# Altium project 105358-3BA001-01_EFM1.PrjPCB
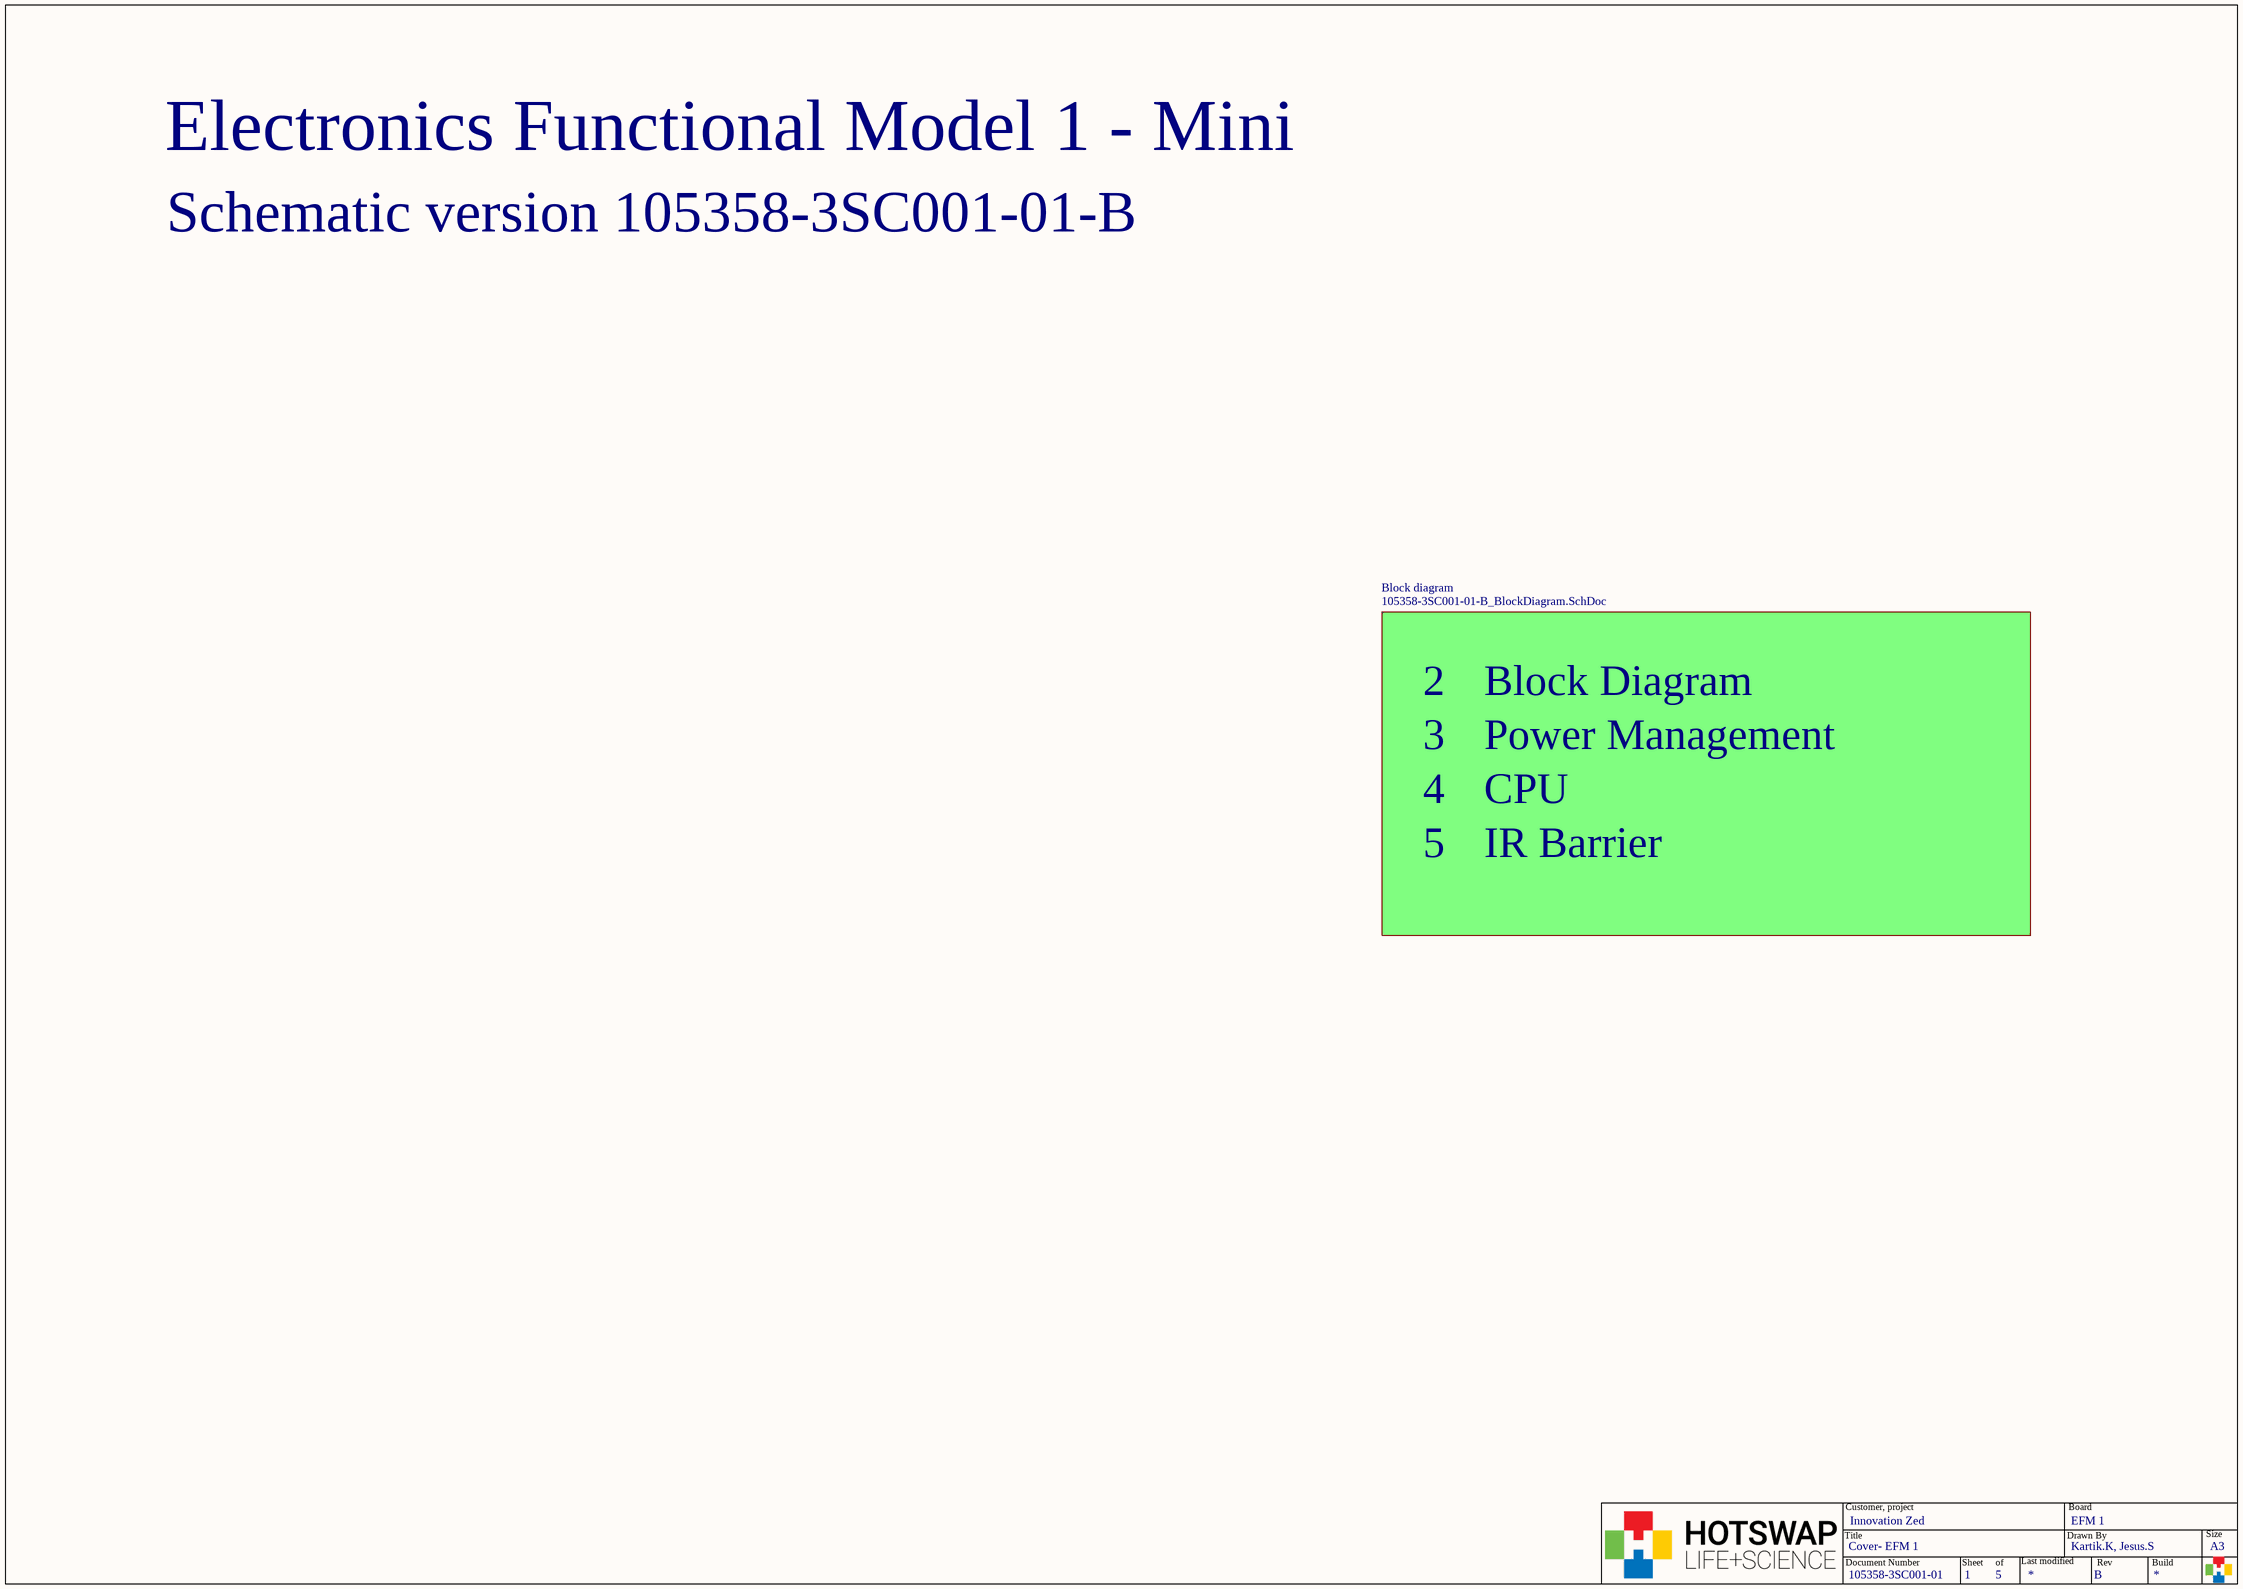
[diagram p0: 105358-3SC001-01-B_Cover.SchDoc]
PrjVersionControl_RevNumber: ' A '; Project_Board: EFM 1; Project_Customer: Innovation Zed; Project_Document_Number: 105358-3BA001-01-B; Project_Drawn_By: Kartik.K, Jesus.S; Project_Revision: B; Project_Total_Sheets: X
5 sheets, 89 parts. Net scope: flat (ports and power ports of the same name join across sheets).
Board file: 105358-3LA001-01_EFM1.PcbDoc
Sheets:
  105358-3SC001-01-B_Cover.SchDoc
    Block diagram = 105358-3SC001-01-B_BlockDiagram.SchDoc
      Power Management = 105358-3SC001-01-B_PWR_MGMT.SchDoc
      CPU Board = 105358-3SC001-01-B_CPU_BRD.SchDoc
      IO Board = 105358-3SC001-01-B_IO_BRD.SchDoc

## Sheet 105358-3SC001-01-B_Cover.SchDoc: Cover- EFM 1
size 420 x 297 mm; DrawnBy: JeSa, KaKa; Organization: Hotswap Norden AB; Address1: Knarrarnäsgatan 7; Address2: SE-164 40 Kista; Address3: Sweden; DocumentNumber: 105358-3SC001-01; SheetNumber: 1; SheetTotal: 5; PageSetup: Record=PageOptions|CenterHorizontal=True|CenterVertical=True|PrintScale=0.98|XCorrection=1.00|YCorrection=1.00|PrintKind=0|BorderSize=5000000|LeftOffset=0|BottomOffset=0|Orientation=2|PaperLength=1000|PaperWidth=1000|Scale=100|PaperSource=7|PrintQuality=-3|MediaType=1|DitherType=10|PrintScaleMode=1|PaperKind=A3|PaperIndex=8

### Sub-sheets
Block diagram = 105358-3SC001-01-B_BlockDiagram.SchDoc: no entries

### Notes on the sheet
- Electronics Functional Model 1 - Mini
- Schematic version 105358-3SC001-01-B
- 2
- Block Diagram
- 3
- Power Management
- 4
- 5
- IR Barrier
- CPU
- Title
- Customer, project
- Drawn By
- Board
- Size
- Document Number
- Sheet
- of
- Last modified
- Rev
- Build
- A3

## Sheet 105358-3SC001-01-B_BlockDiagram.SchDoc: Block Diagram
size 420 x 297 mm; DrawnBy: JeSa , KaKa; Organization: Hotswap Norden AB; Address1: Knarrarnäsgatan 7; Address2: SE-164 40 Kista; Address3: Sweden; DocumentNumber: 105358-3SC001-01; SheetNumber: 2; SheetTotal: 5; PageSetup: Record=PageOptions|CenterHorizontal=True|CenterVertical=True|PrintScale=0.96|XCorrection=1.00|YCorrection=1.00|PrintKind=0|BorderSize=5000000|LeftOffset=0|BottomOffset=0|Orientation=2|PaperLength=1000|PaperWidth=1000|Scale=100|PaperSource=7|PrintQuality=-4|MediaType=1|DitherType=10|PaperKind=A3|PrintScaleMode=1
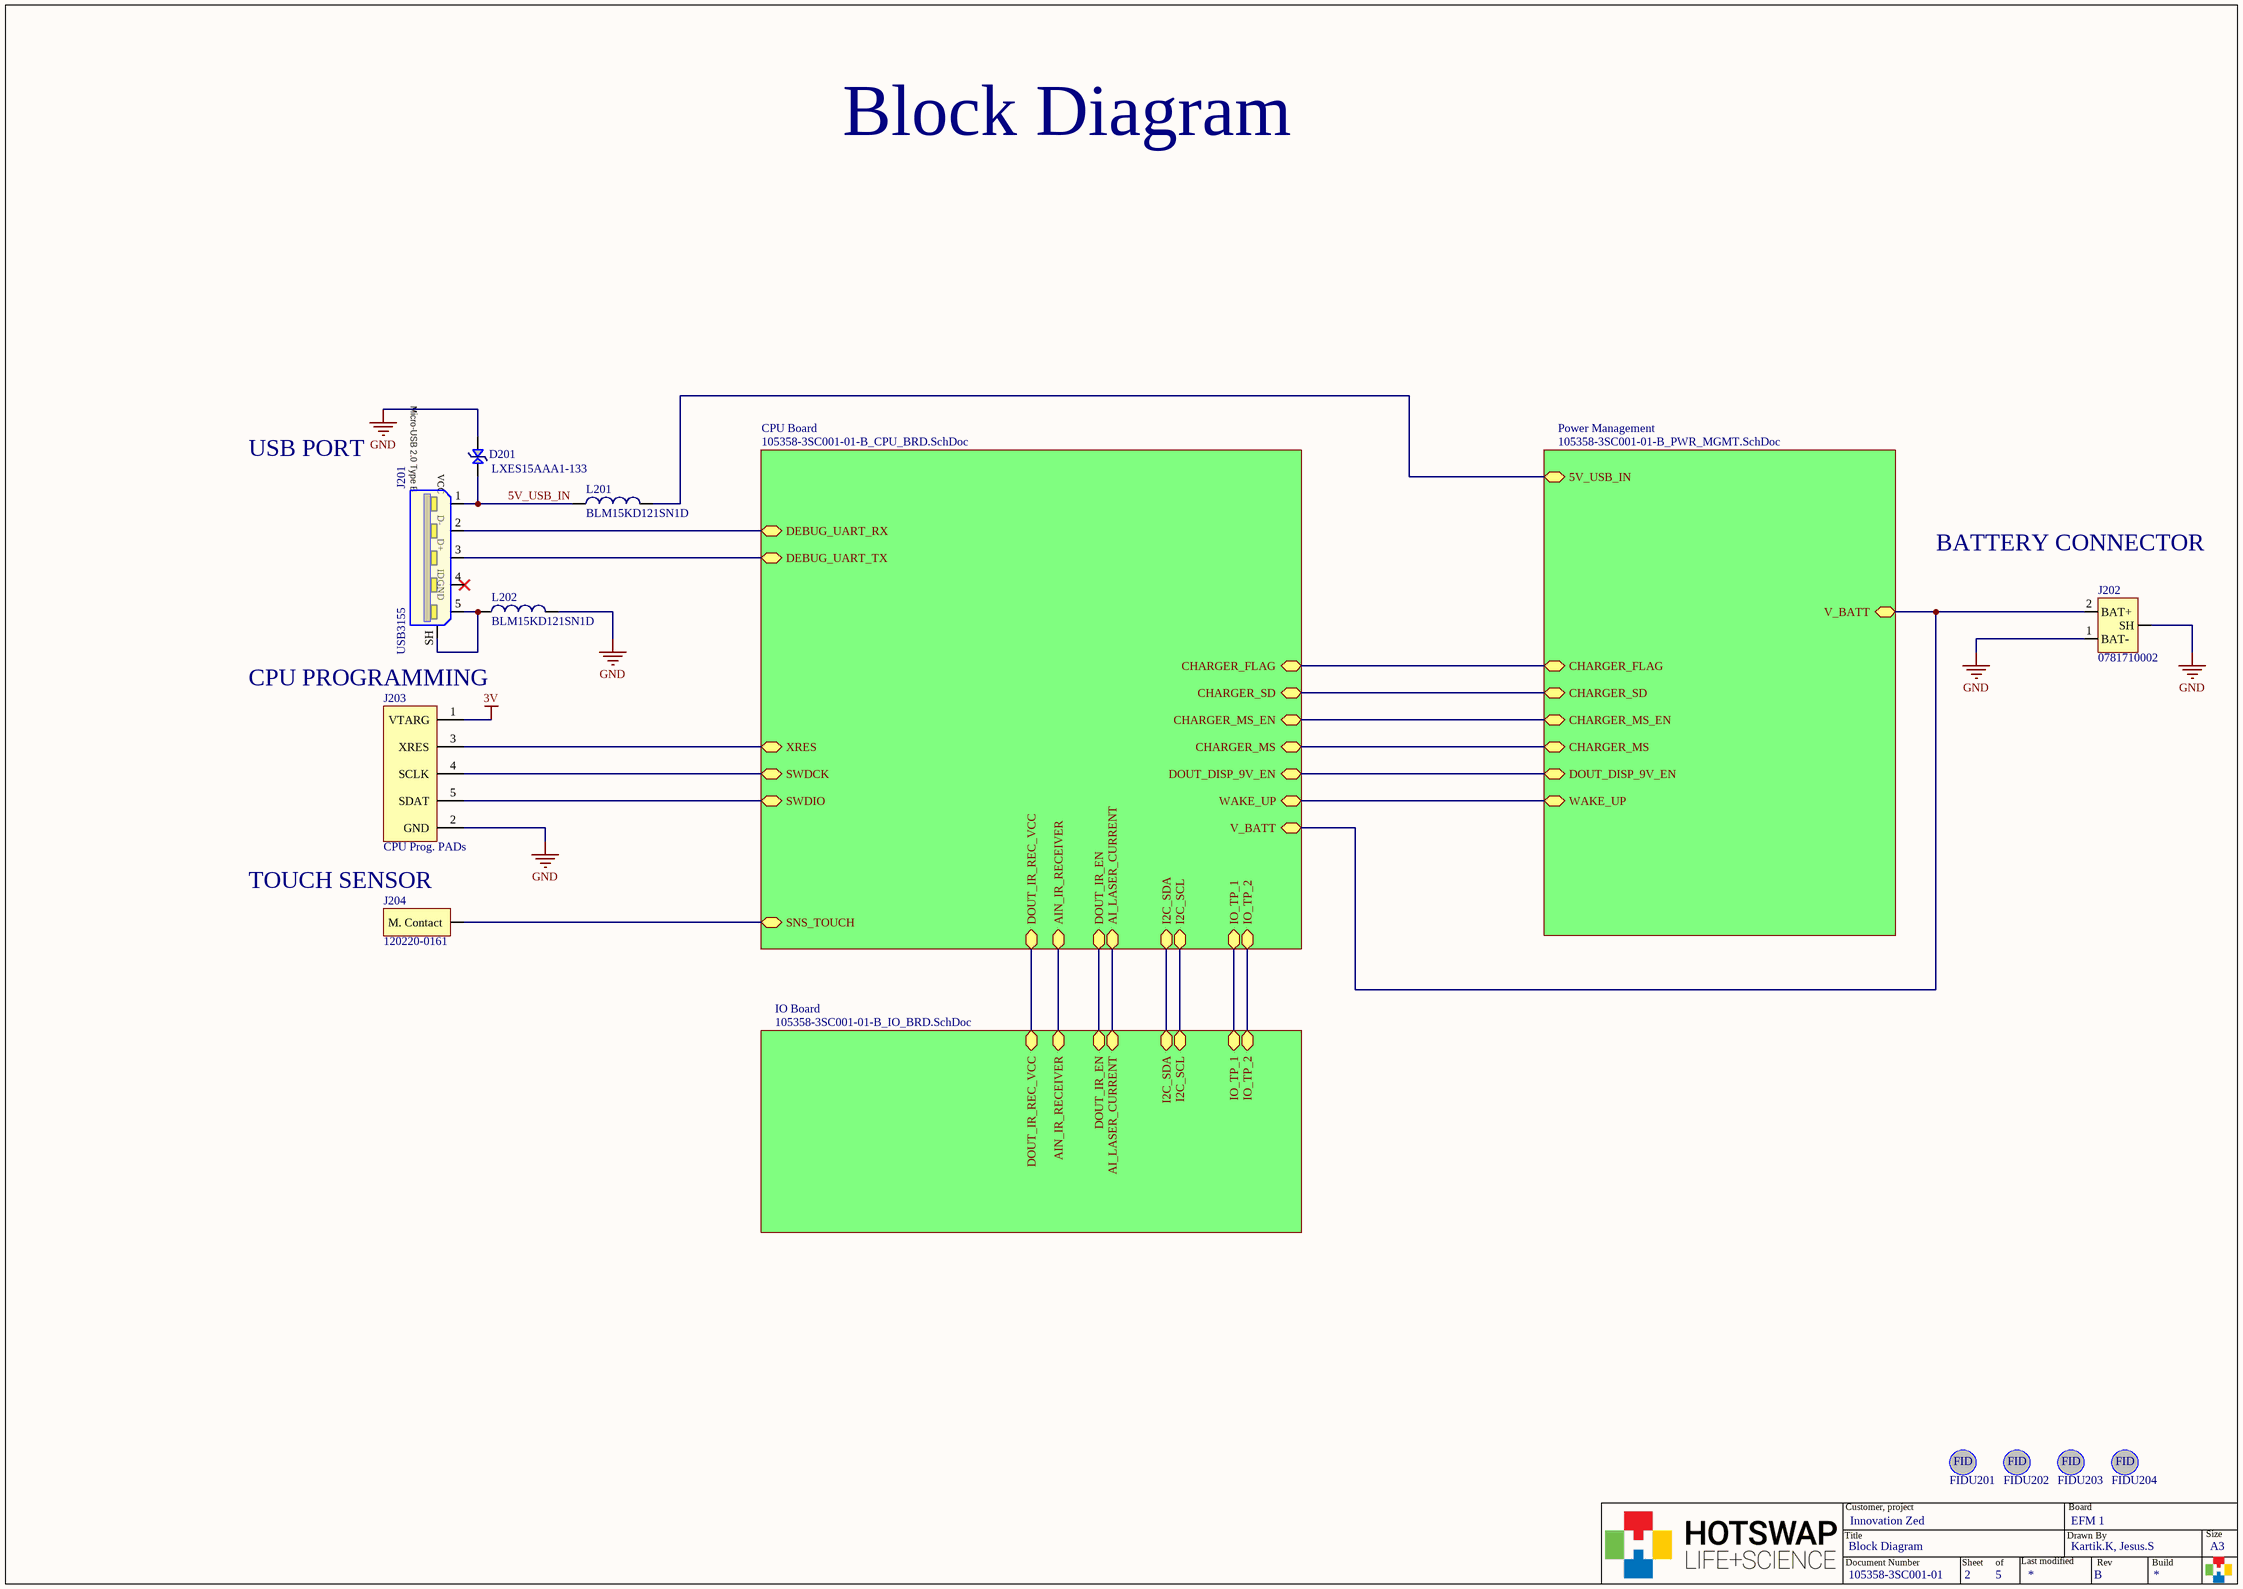
[diagram p1: 105358-3SC001-01-B_BlockDiagram.SchDoc]

### Parts
D201  LXES15AAA1-133  [0402C-GENERIC]
FIDU201  FIDU-miniROUND  [FIDU-MINI-ROUND]  (value not drawn)  (no BOM)
FIDU202  FIDU-miniROUND  [FIDU-MINI-ROUND]  (value not drawn)  (no BOM)
FIDU203  FIDU-miniROUND  [FIDU-MINI-ROUND]  (value not drawn)  (no BOM)
FIDU204  FIDU-miniROUND  [FIDU-MINI-ROUND]  (value not drawn)  (no BOM)
J201  USB3155  [USB3155]
J202  0781710002  [PAD 0781710002]
J203  CPU Prog. PADs  [PAD PROGRAMMING]  (no BOM)
J204  120220-0161  [PAD 1.0x3.76mm]
L201  BLM15KD121SN1D  [0402L_High Speed]
L202  BLM15KD121SN1D  [0402L_High Speed]

### Sub-sheets
CPU Board = 105358-3SC001-01-B_CPU_BRD.SchDoc: DEBUG_UART_TX, CHARGER_FLAG, DEBUG_UART_RX, CHARGER_MS, CHARGER_SD, CHARGER_MS_EN, WAKE_UP, DOUT_DISP_9V_EN, XRES, SWDCK, SWDIO, AIN_IR_RECEIVER, I2C_SDA, I2C_SCL, IO_TP_1, IO_TP_2, SNS_TOUCH, AI_LASER_CURRENT, DOUT_IR_REC_VCC, DOUT_IR_EN, V_BATT
IO Board = 105358-3SC001-01-B_IO_BRD.SchDoc: AIN_IR_RECEIVER, I2C_SDA, I2C_SCL, IO_TP_1, IO_TP_2, AI_LASER_CURRENT, DOUT_IR_REC_VCC, DOUT_IR_EN
Power Management = 105358-3SC001-01-B_PWR_MGMT.SchDoc: CHARGER_FLAG, CHARGER_MS_EN, CHARGER_SD, CHARGER_MS, WAKE_UP, DOUT_DISP_9V_EN, 5V_USB_IN, V_BATT

### Nets
3V: J203.1(VTARG)
GND: D201.1 J202.1(BAT-) J202.3(SH) J203.2(GND) L202.2
5V_USB_IN: D201.2 J201.1(VCC) L201.1  [project net 5V_USB_IN_2]
NetJ201_2: J201.2(D-) ; sheet CPU Board/DEBUG_UART_RX
NetJ201_3: J201.3(D+) ; sheet CPU Board/DEBUG_UART_TX
NetJ201_5: J201.5(GND) J201.SH(Shell) L202.1
NetJ202_2: J202.2(BAT+) ; sheet Power Management/V_BATT, sheet CPU Board/V_BATT
NetJ203_3: J203.3(XRES) ; sheet CPU Board/XRES
NetJ203_4: J203.4(SCLK) ; sheet CPU Board/SWDCK
NetJ203_5: J203.5(SDAT) ; sheet CPU Board/SWDIO
NetJ204_1: J204.1(M._Contact) ; sheet CPU Board/SNS_TOUCH
NetL201_2: L201.2 ; sheet Power Management/5V_USB_IN
(unnamed): sheet Power Management/CHARGER_FLAG, sheet CPU Board/CHARGER_FLAG
(unnamed): sheet Power Management/CHARGER_MS_EN, sheet CPU Board/CHARGER_MS_EN
(unnamed): sheet Power Management/CHARGER_SD, sheet CPU Board/CHARGER_SD
(unnamed): sheet Power Management/CHARGER_MS, sheet CPU Board/CHARGER_MS
(unnamed): sheet Power Management/WAKE_UP, sheet CPU Board/WAKE_UP
(unnamed): sheet Power Management/DOUT_DISP_9V_EN, sheet CPU Board/DOUT_DISP_9V_EN
(unnamed): sheet CPU Board/AIN_IR_RECEIVER, sheet IO Board/AIN_IR_RECEIVER
(unnamed): sheet CPU Board/I2C_SDA, sheet IO Board/I2C_SDA
(unnamed): sheet CPU Board/I2C_SCL, sheet IO Board/I2C_SCL
(unnamed): sheet CPU Board/IO_TP_1, sheet IO Board/IO_TP_1
(unnamed): sheet CPU Board/IO_TP_2, sheet IO Board/IO_TP_2
(unnamed): sheet CPU Board/AI_LASER_CURRENT, sheet IO Board/AI_LASER_CURRENT
(unnamed): sheet CPU Board/DOUT_IR_REC_VCC, sheet IO Board/DOUT_IR_REC_VCC
(unnamed): sheet CPU Board/DOUT_IR_EN, sheet IO Board/DOUT_IR_EN

Not connected (* = marked no-connect by the designer): J201 4(ID)*

### Notes on the sheet
- Block Diagram
- USB PORT
- BATTERY CONNECTOR
- CPU PROGRAMMING
- TOUCH SENSOR
- Title
- Customer, project
- Drawn By
- Board
- Size
- Document Number
- Sheet
- of
- Last modified
- Rev
- Build
- A3
- (in symbol FIDU-miniROUND) FID
- (in symbol USB3155) Micro-USB 2.0 Type B

### Library data of the parts
D201 = TVS DIODE 15VWM 0402: Manufacturer: Murata Electronics North America; Type: Zener; Capacitance @ Frequency: 0.05pF @ 1MHz; Voltage - Reverse Standoff (Typ): 15V; Manufacturer Part Number: LXES15AAA1-133; Digi-Key Part Number: 490-13209-1-ND; PackageReference: 0402
J201 = USB3155: CONN RCPT USB-mini B 2.0 5POS SLD; Manufacturer: GCT (GLOBAL CONNECTOR TECHNOLOGY); Manufacturer Part Number: USB3155-30-A; Connector Type: USB - micro B; ComponentLink1Description: Datasheet; ComponentLink1URL: https://gct.co/files/drawings/usb3155.pdf; Digi-Key Part Number: 2537026-Farnell; ClassName: 3D_EXPORT; ComponentLink2Description: Product Specification; ComponentLink2URL: https://gct.co/files/specs/usb3155-spec.pdf
J202 = CONNECTOR 1.20MM WTB HEADER VERT 2POS: 1.20MM WTB HEADER VERT 2POS; Manufacturer: Molex, LLC; ComponentLink1URL: http://www.molex.com/pdm_docs/sd/781710002_sd.pdf; ComponentLink1Description: Datasheet; Manufacturer Part Number: 0781710002; Mounting Type: Surface Mount; Digi-Key Part Number: WM4459CT-ND; ClassName: 3D_EXPORT
J203 = PROGRAMMING PADS: CPU Programming PADs; ClassName: TP
J204 = UNIVERSAL_CONTACT_2.5MM SMD: UNIVERSAL CONTACT 2.5MM SMD; Manufacturer: ITT Cannon, LLC; ComponentLink1URL: https://media.digikey.com/pdf/Data%20Sheets/ITT%20PDFs/Universal_Contact%202.5mm.pdf; ComponentLink1Description: Datasheet; Manufacturer Part Number: 120220-0161; Mounting Type: Surface Mount; Digi-Key Part Number: 1003-1009-1-ND; ClassName: 3D_EXPORT
L201 L202 = 0402L_FERRITE BEAD: FERRITE BEAD 120 OHM 0402 1LN; Manufacturer: Murata Electronics North America; Number of Lines: 1; Current Rating (Max): 1.5A; Impedance @ Frequency: 120 Ohm @ 100MHz; DC Resistance (DCR) (Max): 70 mOhm; Filter Type: Signal Line; Digi-Key Part Number: 490-15015-1-ND; Manufacturer Part Number: BLM15KD121SN1D; ComponentLink1Description: Datasheet; ComponentLink1URL: http://www.murata.com/en-us/products/productdata/8796740059166/ENFA0018.pdf; PackageReference: 0402 (1005 Metric)
FIDU201-FIDU204 = FIDU-miniROUND: ClassName: FIDU

## Sheet 105358-3SC001-01-B_PWR_MGMT.SchDoc: Power Management
size 420 x 297 mm; DrawnBy: JeSa, KaKa; Organization: Hotswap Norden AB; Address1: Knarrarnäsgatan 7; Address2: SE-164 40 Kista; Address3: Sweden; DocumentNumber: 105358-3SC001-01; SheetNumber: 3; SheetTotal: 5; PageSetup: Record=PageOptions|CenterHorizontal=True|CenterVertical=True|PrintScale=0.96|XCorrection=1.00|YCorrection=1.00|PrintKind=0|BorderSize=5000000|LeftOffset=0|BottomOffset=0|Orientation=2|PaperLength=1000|PaperWidth=1000|Scale=100|PaperSource=7|PrintQuality=-4|MediaType=1|DitherType=10|PaperKind=A3|PrintScaleMode=1
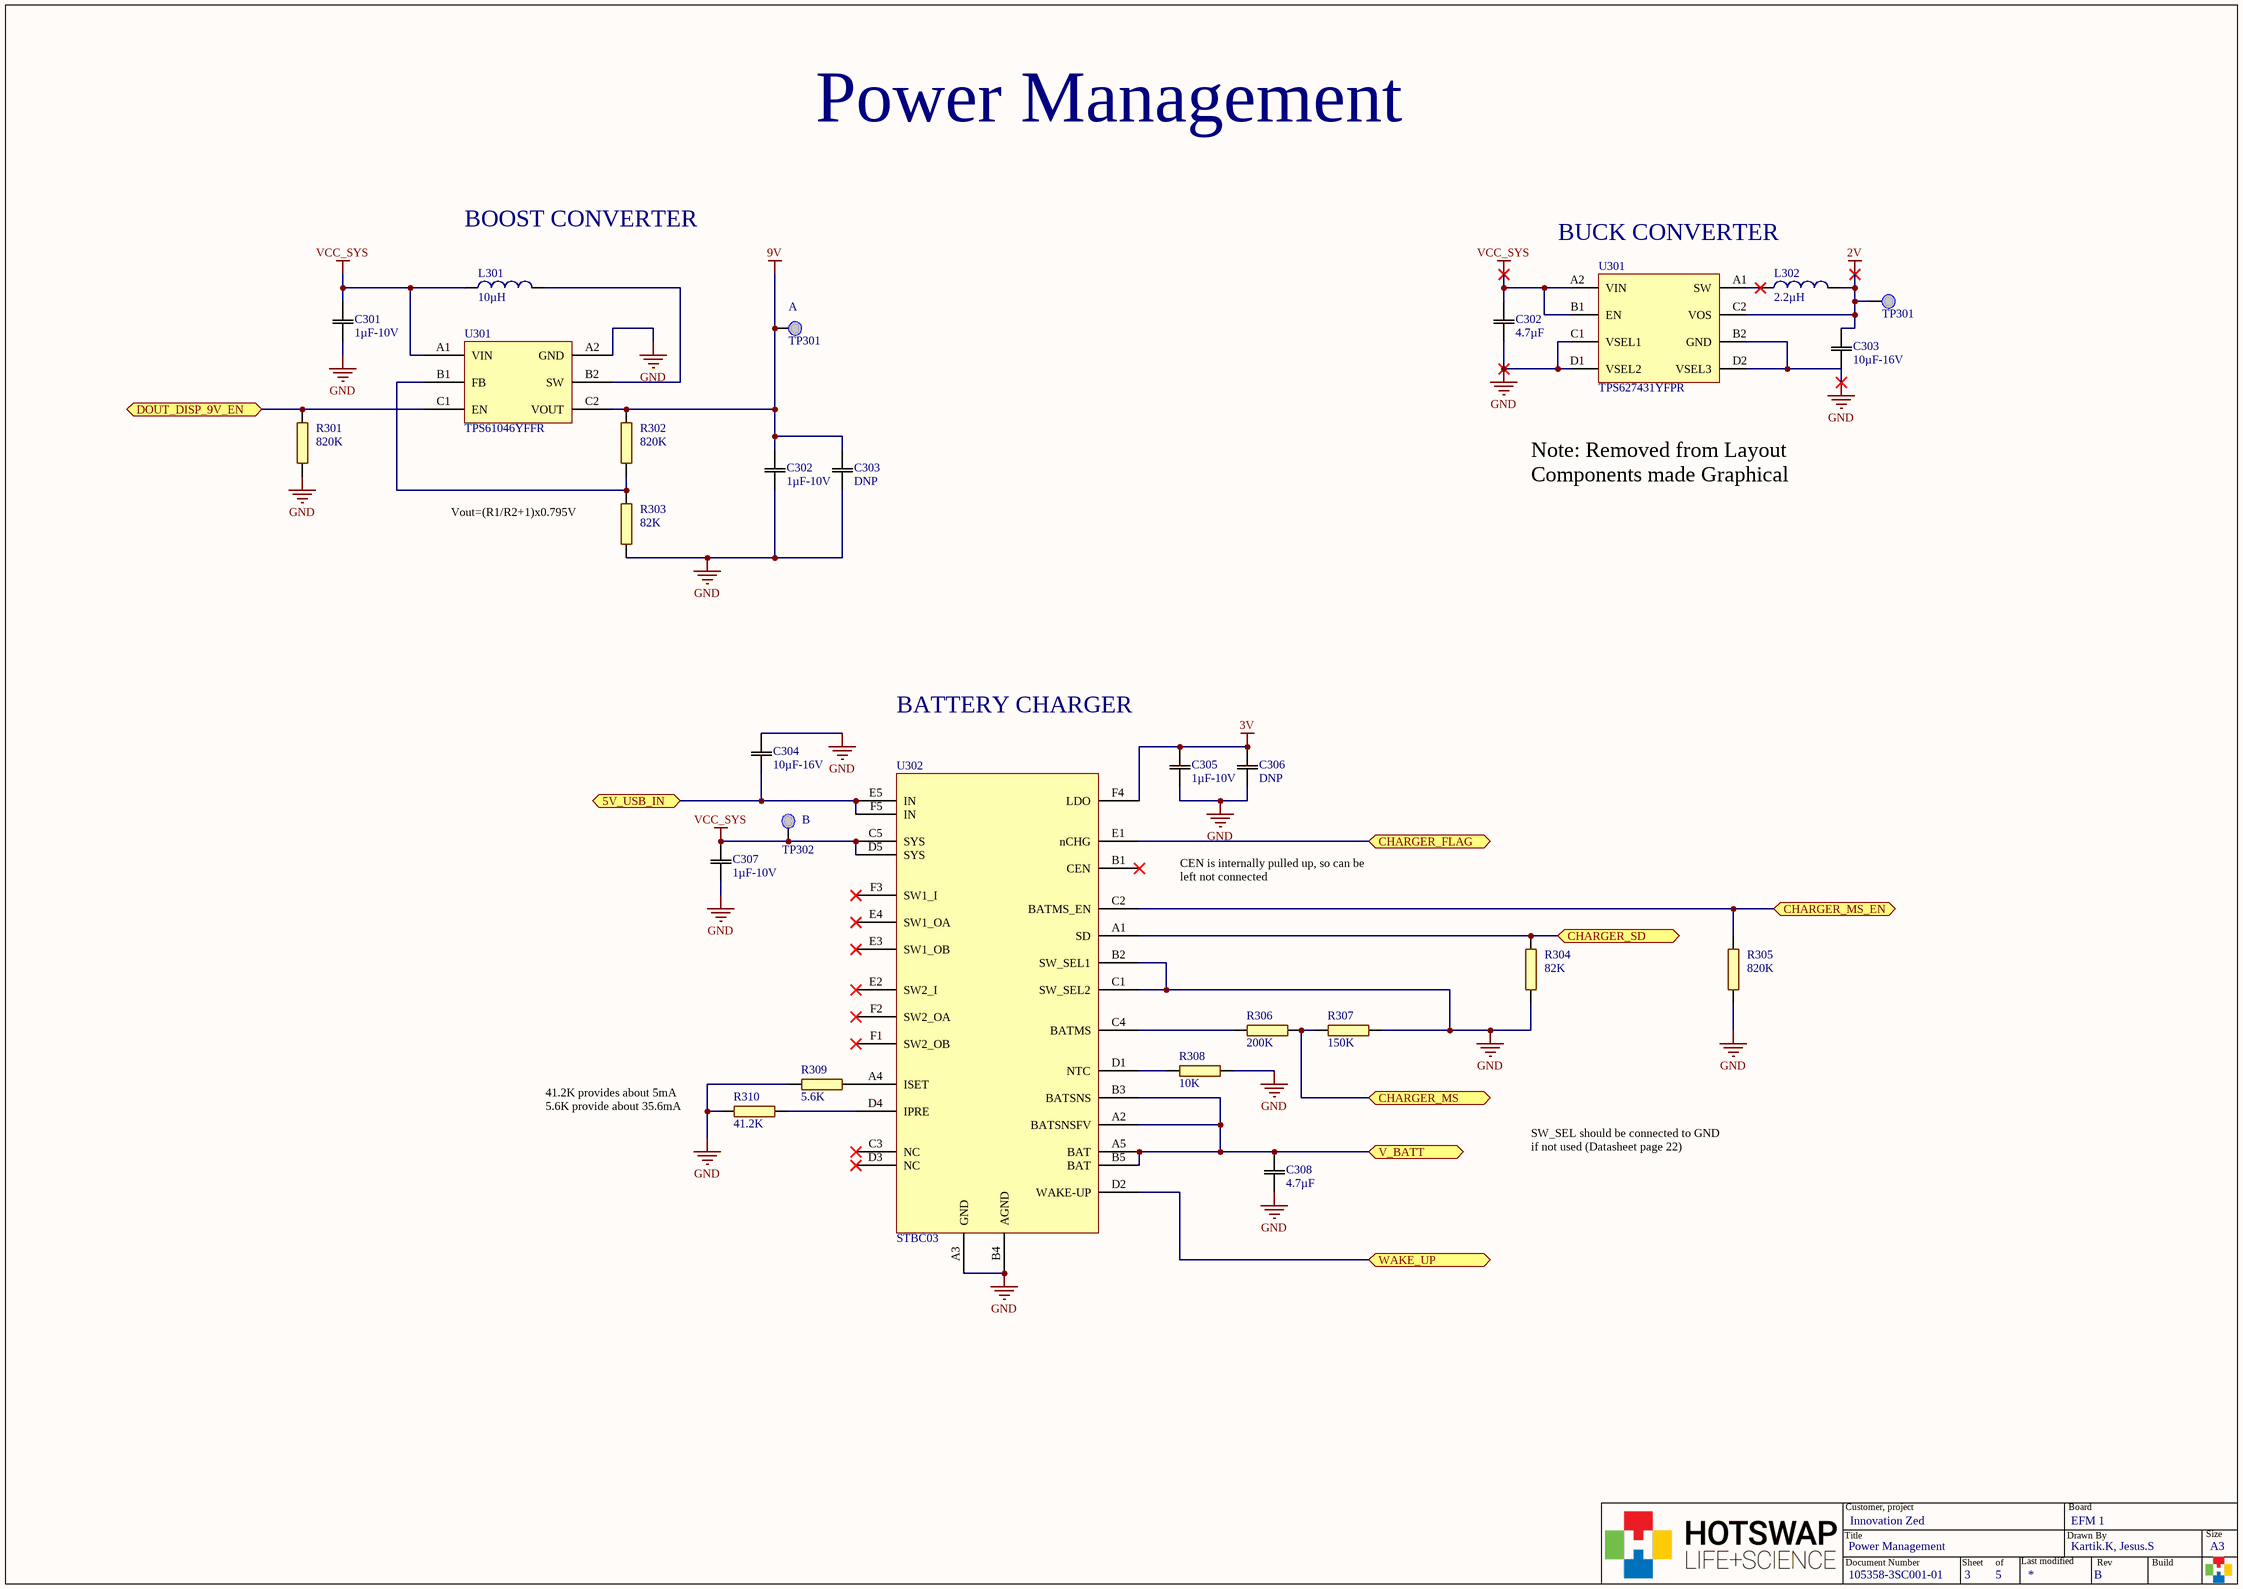
[diagram p2: 105358-3SC001-01-B_PWR_MGMT.SchDoc]

### Parts
(Parts that share a designator on the sheet are numbered #1, #2 ... from top to bottom, then left to right.)
C301  1µF-10V  [0402C_HIGH_DENSITY]
C302#1  4.7µF  [0402C_HIGH_DENSITY]  (graphical)
C302#2  1µF-10V  [0402C_HIGH_DENSITY]
C303#1  10µF-16V  [0603C_HIGH_DENSITY]  (graphical)
C303#2  DNP  [0402C-GENERIC]
C304  10µF-16V  [0603C_HIGH_DENSITY]
C305  1µF-10V  [0402C_HIGH_DENSITY]
C306  DNP  [0603C-GENERIC]
C307  1µF-10V  [0402C_HIGH_DENSITY]
C308  4.7µF  [0402C_HIGH_DENSITY]
L301  10µH  [0805L_HIGH_DENSITY]
L302  2.2µH  [0805L_HIGH_DENSITY]  (graphical)
R301  820K  [0402R-GENERIC]
R302  820K  [0402R-GENERIC]
R303  82K  [0402R-GENERIC]
R304  82K  [0402R-GENERIC]
R305  820K  [0402R-GENERIC]
R306  200K  [0402R-GENERIC]
R307  150K  [0402R-GENERIC]
R308  10K  [0402R-GENERIC]
R309  5.6K  [0402R-GENERIC]
R310  41.2K  [0402R-GENERIC]
TP301#1  TEST POINT  [PAD TEST POINT]  (value not drawn)  (graphical)
TP301#2  TEST POINT  [PAD TEST POINT]  (value not drawn)  (no BOM)
TP302  TEST POINT  [PAD TEST POINT]  (value not drawn)  (no BOM)
U301#1  TPS627431YFPR  [TPS627431YFPR]  (graphical)
U301#2  TPS61046YFFR  [TPS61046YFFR]
U302  STBC03  [STBC03]

### Ports
5V_USB_IN, CHARGER_FLAG, CHARGER_MS, CHARGER_MS_EN, CHARGER_SD, DOUT_DISP_9V_EN, V_BATT, WAKE_UP

### Nets
2V: C303#1.2 L302.2 TP301#1.1(Test_Point) U301#1.C2(VOS)
3V: C305.2 C306.2 U302.F4(LDO)
9V: C302#2.2 C303#2.2 R302.1 TP301#2.1(Test_Point) U301#2.C2(VOUT)
GND: C301.1 C302#1.1 C302#2.1 C303#1.1 C303#2.1 C304.2 C305.1 C306.1 C307.1 C308.1 R301.2 R303.2 R304.2 R305.2 R307.2 R308.2 R309.1 R310.1 U301#1.B2(GND) U301#1.C1(VSEL1) U301#1.D1(VSEL2) U301#1.D2(VSEL3) U301#2.A2(GND) U302.A3(GND) U302.B2(SW_SEL1) U302.B4(AGND) U302.C1(SW_SEL2)
VCC_SYS: C301.2 C302#1.2 C307.2 L301.1 TP302.1(Test_Point) U301#1.A2(VIN) U301#1.B1(EN) U301#2.A1(VIN) U302.C5(SYS) U302.D5(SYS)
CHARGER_SD: R304.1 U302.A1(SD) ; port CHARGER_SD
NetC304_1: C304.1 U302.E5(IN) U302.F5(IN) ; port 5V_USB_IN
NetC308_2: C308.2 U302.A2(BATSNSFV) U302.A5(BAT) U302.B3(BATSNS) U302.B5(BAT) ; port V_BATT
NetL301_2: L301.2 U301#2.B2(SW)
NetL302_1: L302.1 U301#1.A1(SW)
NetMOD401_4: R306.2 R307.1 ; port CHARGER_MS
NetMOD401_8: U302.E1(nCHG) ; port CHARGER_FLAG
NetQ401_D: U302.D2(WAKE-UP) ; port WAKE_UP
NetR301_1: R301.1 U301#2.C1(EN) ; port DOUT_DISP_9V_EN
NetR302_2: R302.2 R303.1 U301#2.B1(FB)
NetR305_1: R305.1 U302.C2(BATMS_EN) ; port CHARGER_MS_EN
NetR306_1: R306.1 U302.C4(BATMS)
NetR308_1: R308.1 U302.D1(NTC)
NetR309_2: R309.2 U302.A4(ISET)
NetR310_2: R310.2 U302.D4(IPRE)

Not connected (* = marked no-connect by the designer): U302 B1(CEN)* C3(NC)* D3(NC)* E2(SW2_I)* E3(SW1_OB)* E4(SW1_OA)* F1(SW2_OB)* F2(SW2_OA)* F3(SW1_I)*

### Notes on the sheet
- Power Management
- BOOST CONVERTER
- BUCK CONVERTER
- (near TP301#2) A
- (near R303) Vout=(R1/R2+1)x0.795V
- Note: Removed from Layout
  Components made Graphical
- BATTERY CHARGER
- (near TP302) B
- CEN is internally pulled up, so can be left not connected
- (near R310) 41.2K provides about 5mA
  5.6K provide about 35.6mA
- SW_SEL should be connected to GND
  if not used (Datasheet page 22)
- Title
- Customer, project
- Drawn By
- Board
- Size
- Document Number
- Sheet
- of
- Last modified
- Rev
- Build
- A3

### Library data of the parts
C301 C302#2 C305 C307 = 0402C-1uF-10V: 1µF ±10% 10V X5R Ceramic Capacitor 0402; Manufacturer Part Number: CC0402KRX5R6BB105; Manufacturer: Yageo; Capacitance: 1µF; Digi-Key Part Number: 311-1439-1-ND; PackageReference: 0402; Temperature Coefficient: X5R; Tolerance: 10%; Voltage - Rated: 10V
C302#1 C308 = 0402C-4.7uF-6.3V: 4.7µF ±10% 6.3V X5R Ceramic Capacitor 0402; Manufacturer Part Number: C1005X5R0J475K050BC; Manufacturer: TDK Corporation; Capacitance: 4.7µF; Digi-Key Part Number: 445-5947-1-ND; PackageReference: 0402; Temperature Coefficient: X5R; Tolerance: 10%; Voltage - Rated: 6.3V
C303#1 C304 = 0603C-10uF-16V: 16µF ±10% 16V X5R Ceramic Capacitor 0603; Manufacturer Part Number: GRT188R61C106KE13D; Manufacturer: Murata Electronics North America; Capacitance: 10µF; Digi-Key Part Number: 490-12317-1-ND; PackageReference: 0603; Temperature Coefficient: X5R; Tolerance: 10%; Voltage - Rated: 16V; ClassName: 3D_IGNORE
C303#2 = 0402C-DNP-6.3V: Temperature Coefficient: X5R; Tolerance: 10%; Voltage - Rated: 6.3V; Capacitance: DNP; PackageReference: 0402
C306 = 0603C-DNP=10uF-10V: Manufacturer Part Number: GRM188R61A106KE69D; Manufacturer: Murata Electronics North America; Capacitance: 10µF; Temperature Coefficient: X5R; Tolerance: 10%; Voltage - Rated: 10V; Digi-Key Part Number: 490-10474-1-ND; PackageReference: 0603
L301 = 0805L-10uH-0.39Ohm: FIXED IND 10UH 500MA 300 MOHM; Manufacturer: TDK Corporation; Manufacturer Part Number: MLZ2012N100LT000; Number of Lines: 1; Current Rating (Max): 350mA; Tolerance: 20%; DCRDC Resistance (DCR): 390 mOhm Max; Digi-Key Part Number: 445-6762-1-ND; Impedance: 10µH; ComponentLink1Description: Datasheet; ComponentLink1URL: https://product.tdk.com/info/en/catalog/datasheets/inductor_commercial_decoupling_mlz2012_en.pdf; PackageReference: 0805
L302 = 0805L-2.2uH-0.2Ohm: FIXED IND 2.2UH 600MA 0.2OHM SMD; Manufacturer: TDK Corporation; Manufacturer Part Number: MLZ2012M2R2HTD25; Number of Lines: 1; Tolerance: 20%; Digi-Key Part Number: 445-17077-1-ND; Impedance: 2.2µH; Current Rating (Max): 600mA; ComponentLink1Description: Datasheet; ComponentLink1URL: https://www.digikey.com/product-detail/en/tdk-corporation/MLZ2012M2R2HTD25/445-17077-2-ND/4743205; PackageReference: 0805
R301 R302 R305 = 0402R-820k OHM-1%-0.063W: RES SMD 820kOHM 1% 1/16W 0402; Manufacturer: Yageo; Manufacturer Part Number: RC0402FR-07820KL; Power: 0.063W; GENERIC_OK: YES; Digi-Key Part Number: YAG3240CT-ND; Resistance (Ohms): 820KOhm; Tolerance: 1%; PackageReference: 0402
R303 R304 = 0402R-82k OHM-1%-0.063W: RES SMD 82kOHM 1% 1/16W 0402; Manufacturer: Yageo; Manufacturer Part Number: RC0402FR-0782KL; Power: 0.063W; GENERIC_OK: YES; Digi-Key Part Number: 311-82.0KLRCT-ND; Resistance (Ohms): 82KOhm; Tolerance: 1%; PackageReference: 0402
R306 = 0402R-200k OHM-1%-0.063W: RES SMD 200kOHM 1% 1/16W 0402; Manufacturer: Yageo; Manufacturer Part Number: AC0402FR-07200KL; Power: 0.063W; GENERIC_OK: YES; Digi-Key Part Number: YAG3452CT-ND; Resistance (Ohms): 200KOhm; Tolerance: 1%; PackageReference: 0402; Features: Moisture Resistant
R307 = 0402R-150k OHM-5%-0.063W: RES SMD 150kOHM 5% 1/16W 0402; Manufacturer: Yageo; Manufacturer Part Number: RC0402JR-07150KL; Power: 0.063W; GENERIC_OK: YES; Digi-Key Part Number: 311-150KJRCT-ND; Resistance (Ohms): 150KOhm; Tolerance: 5%; PackageReference: 0402; Features: Moisture Resistant
R308 = 0402R-10k OHM-1%-0.063W: RES SMD 10kOHM 1% 1/16W 0402; Manufacturer: Yageo; Manufacturer Part Number: RC0402FR-0710KL; Power: 0.063W; GENERIC_OK: YES; Digi-Key Part Number: 311-10.0KLRCT-ND; Resistance (Ohms): 10KOhm; Tolerance: 1%; PackageReference: 0402; Features: Moisture Resistant
R309 = 0402R-5.6k OHM-5%-0.063W: RES SMD 5.6kOHM 5% 1/16W 0402; Manufacturer: Yageo; Manufacturer Part Number: RC0402JR-075K6L; Power: 0.063W; GENERIC_OK: YES; Digi-Key Part Number: 311-5.6KJRCT-ND; Resistance (Ohms): 5.6KOhm; Tolerance: 5%; PackageReference: 0402
R310 = 0402R-41.2k OHM-1%-0.063W: RES SMD 41.2kOHM 1% 1/16W 0402; Manufacturer: Yageo; Manufacturer Part Number: RC0402FR-0741K2L; Power: 0.063W; GENERIC_OK: YES; Digi-Key Part Number: YAG3155CT-ND; Resistance (Ohms): 41.2KOhm; Tolerance: 1%; PackageReference: 0402
TP301#1 TP301#2 TP302 = TEST POINT: Testing Poiny; ClassName: TP
U301#1 = TPS627431YFPR: Buck Converter; Manufacturer: Texas Instruments; Output Configuration: Positive; Function: Step-Down; Voltage - Input (Min): 2.15V; Voltage - Input (Max): 5.5V; Voltage - Output (Min/Fixed): 1.3V; Voltage - Output (Max): 3.1V; Current - Output: 400mA; Frequency - Switching: 1.2MHz; Synchronous Rectifier: Yes; ComponentLink1URL: http://www.ti.com/lit/ds/symlink/tps62743.pdf; ComponentLink1Description: Datasheet; Manufacturer Part Number: TPS627431YFPR; PackageReference: 8-XFBGA, DSBGA; Digi-Key Part Number: 296-44499-2-ND
U301#2 = TPS61046YFFR: Boost converter 28V; Manufacturer: Texas Instruments; Voltage - Supply (Min): 1.8V; Voltage - Supply (Max): 5.5V; Voltage - Output: 4.5 V ~ 28 V; Current - Output / Channe: 1.2A (Switch); Frequency: 1.05MHz; Supplier 1: Digi-Key; Supplier Part Number 1: 296-44337-1-ND; ComponentLink1URL: http://www.ti.com/lit/ds/symlink/tps61046.pdf; ComponentLink1Description: Datasheet; Manufacturer Part Number: TPS61046YFFR; PackageReference: 6-UFBGA, DSBGA; Digi-Key Part Number: 296-44337-1-ND
U302 = STBC03: Li-Ion linear battery charger; Manufacturer Part Number: STBC03JR; Manufacturer: STMicroelectronics; Battery Chemistry: Lithium-Ion/Polymer; Battery Pack Voltag: 4.2V; Voltage - Supply (Max): 5.4V; Charge Current - Max: 650mA; ComponentLink1URL: http://www.st.com/content/ccc/resource/technical/document/datasheet/group3/05/ea/e8/4e/a7/a6/4a/c6/DM00338132/files/DM00338132.pdf/jcr:content/translations/en.DM00338132.pdf; ComponentLink1Description: Datasheet; PackageReference: 30-UFBGA, FCBGA; Digi-Key Part Number: 497-17241-1-ND

## Sheet 105358-3SC001-01-B_CPU_BRD.SchDoc: CPU Board
size 420 x 297 mm; DrawnBy: JeSa , KaKa; Organization: Hotswap Norden AB; Address1: Knarrarnäsgatan 7; Address2: SE-164 40 Kista; Address3: Sweden; DocumentNumber: 105358-3SC001-01; SheetNumber: 4; SheetTotal: 5; PageSetup: Record=PageOptions|CenterHorizontal=True|CenterVertical=True|PrintScale=0.96|XCorrection=1.00|YCorrection=1.00|PrintKind=0|BorderSize=5000000|LeftOffset=0|BottomOffset=0|Orientation=2|PaperLength=1000|PaperWidth=1000|Scale=100|PaperSource=7|PrintQuality=-4|MediaType=1|DitherType=10|PaperKind=A3|PrintScaleMode=1
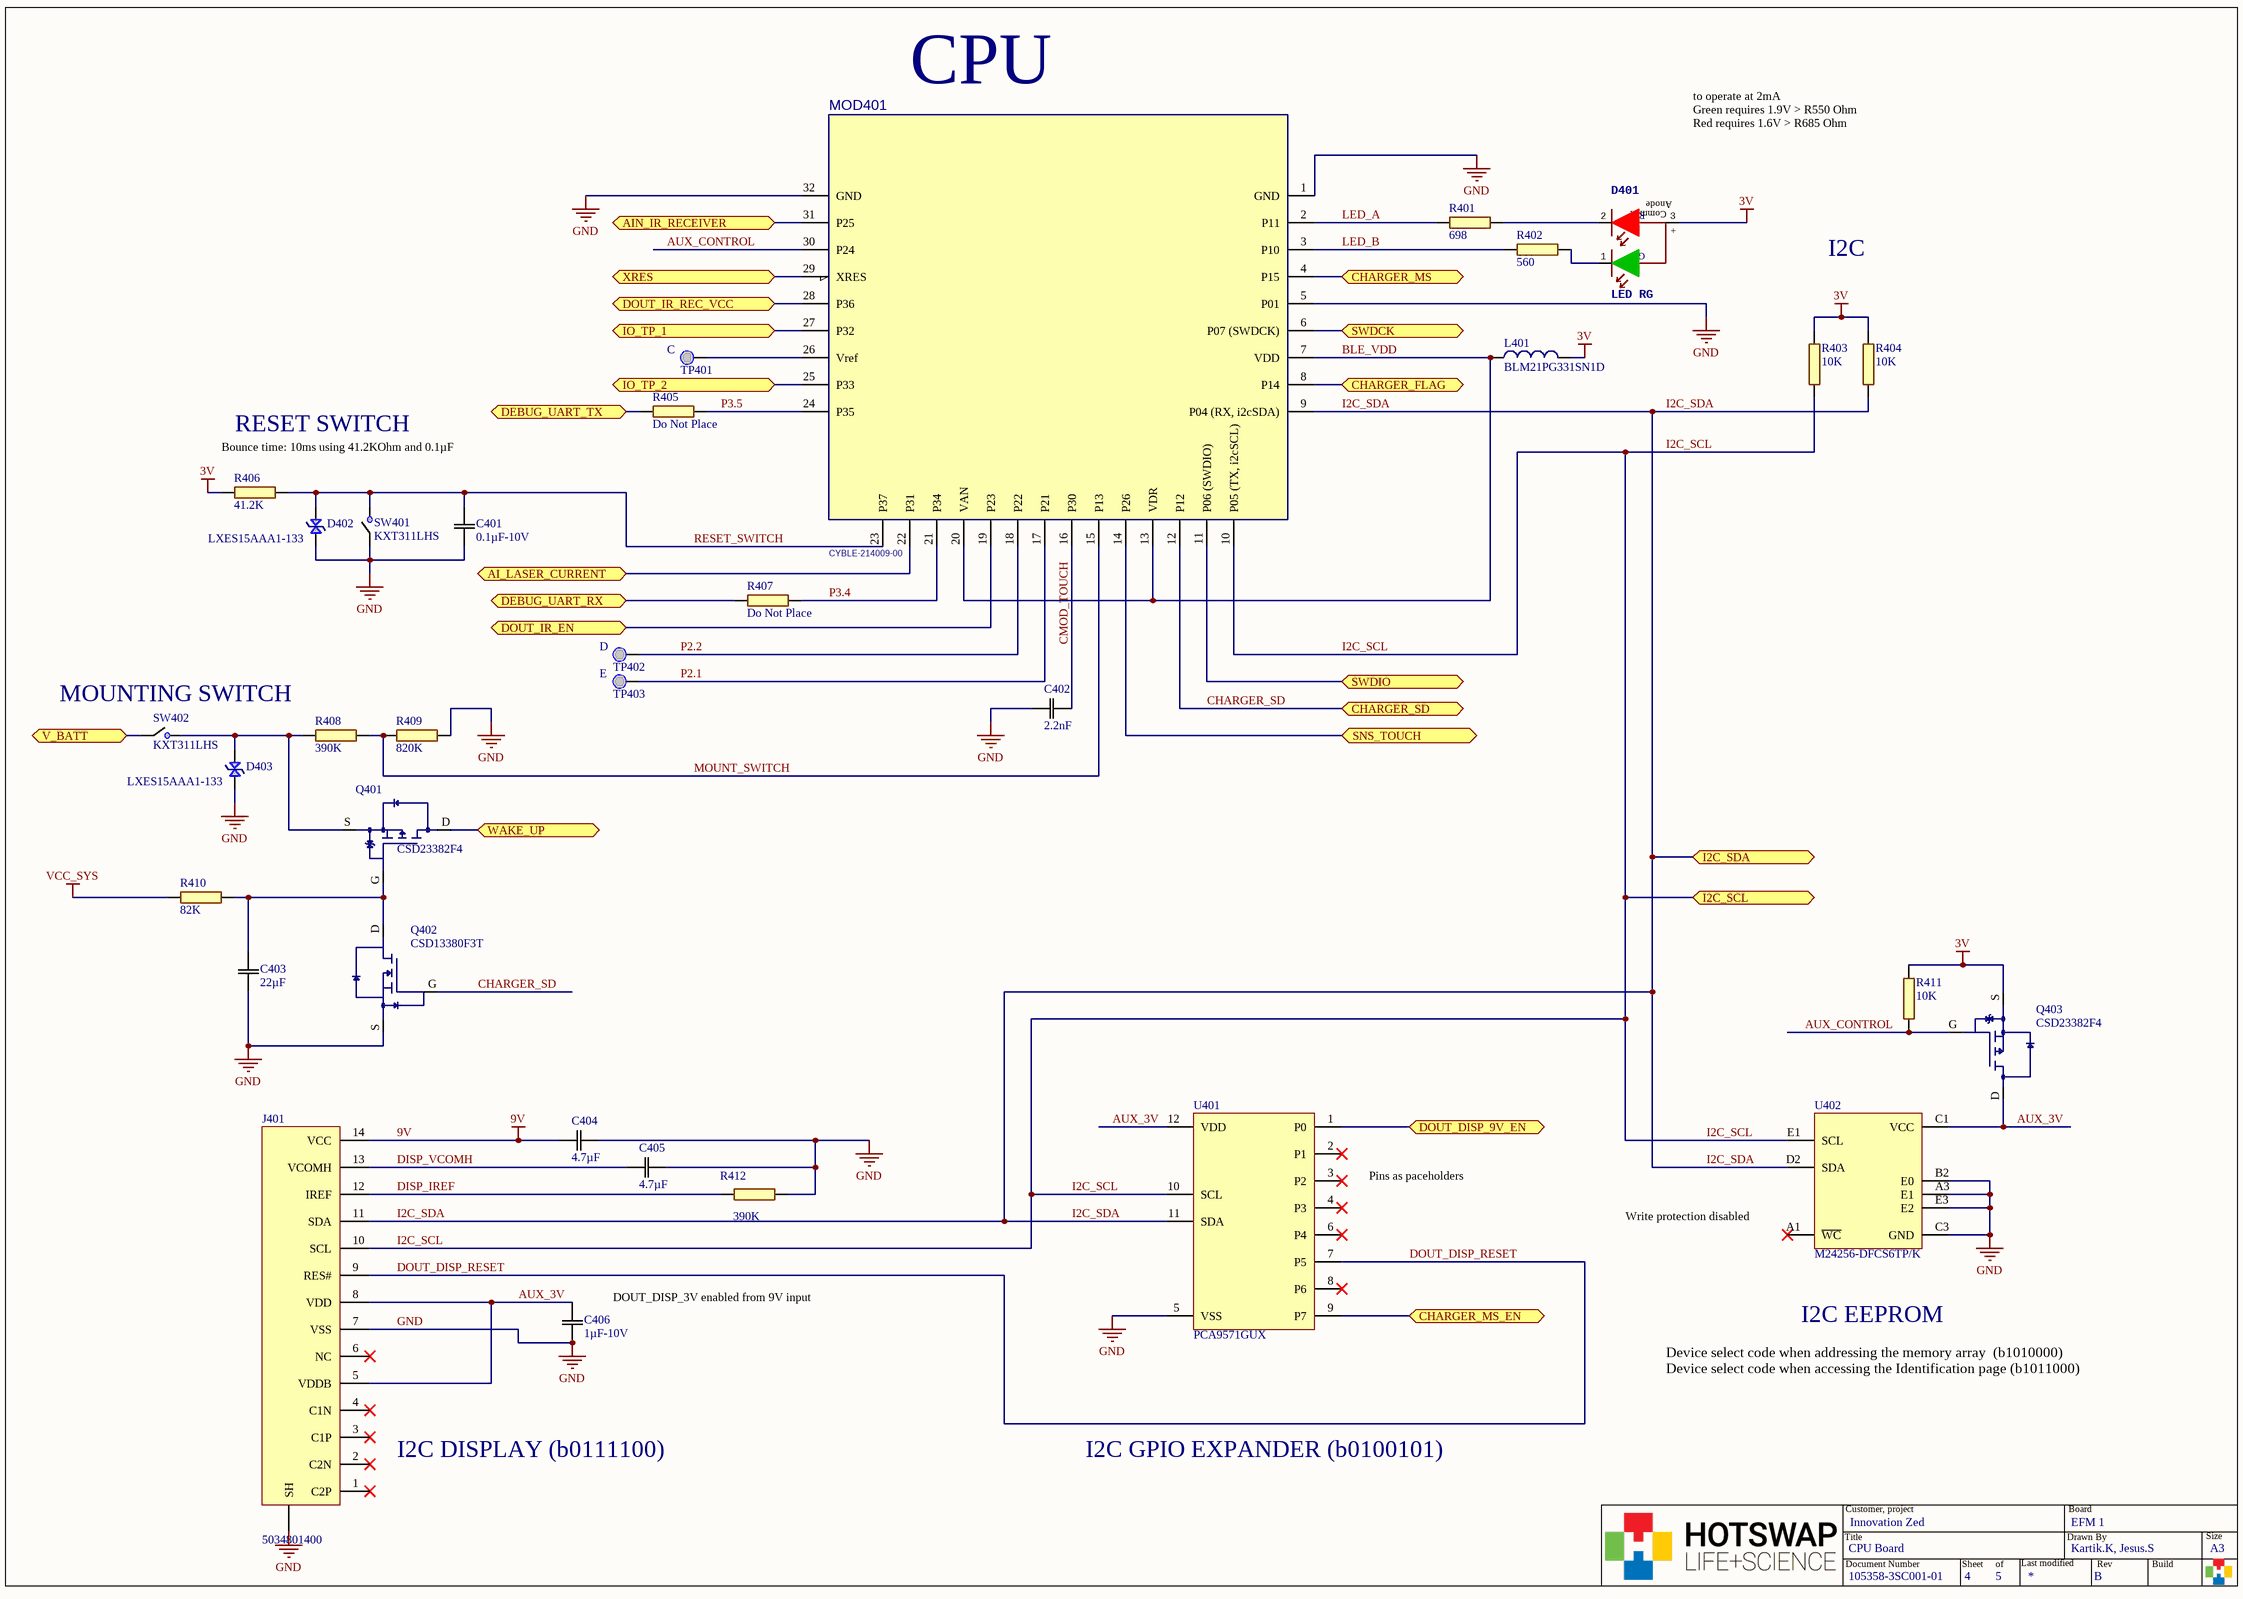
[diagram p3: 105358-3SC001-01-B_CPU_BRD.SchDoc]

### Parts
C401  0.1µF-10V  [0402C_HIGH_DENSITY]
C402  2.2nF  [0402C_HIGH_DENSITY]
C403  22µF  [0603C-GENERIC]
C404  4.7µF  [0402C_HIGH_DENSITY]
C405  4.7µF  [0402C_HIGH_DENSITY]
C406  1µF-10V  [0402C_HIGH_DENSITY]
D401  LED RG  [LED GRN/RED DIFF 1208 R/A SMD]
D402  LXES15AAA1-133  [0402C-GENERIC]
D403  LXES15AAA1-133  [0402C-GENERIC]
J401  5034801400  [5034801400]  (no BOM)
L401  BLM21PG331SN1D  [0805L_HIGH_DENSITY - Hybrid 0402]
MOD401  CYBLE-214009-00  [CYBLE-014008-00_MinKeepOut]
Q401  CSD23382F4  [CSD23382F4 -DFN65P100X35-3L]
Q402  CSD13380F3T  [CSD13380F3-DFN40P69X35-3L]
Q403  CSD23382F4  [CSD23382F4 -DFN65P100X35-3L]
R401  698  [0402R-GENERIC]
R402  560  [0402R-GENERIC]
R403  10K  [0402R-GENERIC]
R404  10K  [0402R-GENERIC]
R405  Do Not Place  [0402R-GENERIC]
R406  41.2K  [0402R-GENERIC]
R407  Do Not Place  [0402R-GENERIC]
R408  390K  [0402R-GENERIC]
R409  820K  [0402R-GENERIC]
R410  82K  [0402R-GENERIC]
R411  10K  [0402R-GENERIC]
R412  390K  [0402R-GENERIC]
SW401  KXT311LHS  [KXT311LHS_B]
SW402  KXT311LHS  [KXT311LHS_B]
TP401  TEST POINT  [PAD TEST POINT]  (value not drawn)  (no BOM)
TP402  TEST POINT  [PAD TEST POINT]  (value not drawn)  (no BOM)
TP403  TEST POINT  [PAD TEST POINT]  (value not drawn)  (no BOM)
U401  PCA9571GUX  [PCA9571-XQFN12]
U402  M24256-DFCS6TP/K  [BGAS8_M24256-DFCS6_1]

### Ports
AI_LASER_CURRENT, AIN_IR_RECEIVER, CHARGER_FLAG, CHARGER_MS, CHARGER_MS_EN, CHARGER_SD, DEBUG_UART_RX, DEBUG_UART_TX, DOUT_DISP_9V_EN, DOUT_IR_EN, DOUT_IR_REC_VCC, I2C_SCL, I2C_SDA, IO_TP_1, IO_TP_2, SNS_TOUCH, SWDCK, SWDIO, V_BATT, WAKE_UP, XRES

### Nets
3V: D401.3 L401.2 Q403.S R403.1 R404.1 R406.1 R411.1
9V: C404.1 J401.14(VCC)
GND: C401.1 C402.2 C403.1 C404.2 C405.1 C406.1 D402.1 D403.1 J401.7(VSS) J401.SH MOD401.1(GND) MOD401.5(P01) MOD401.32(GND) Q402.S R409.1 R412.2 SW401.1 U401.5(VSS) U402.A3(E1) U402.B2(E0) U402.C3(GND) U402.E3(E2)
VCC_SYS: R410.1
AUX_3V: C406.2 J401.5(VDDB) J401.8(VDD) Q403.D U401.12(VDD) U402.C1(VCC)  [project net AUX_3V_4]
AUX_CONTROL: MOD401.30(P24) Q403.G R411.2  [project net AUX_CONTROL_4]
BLE_VDD: L401.1 MOD401.7(VDD) MOD401.13(VDR) MOD401.20(VAN)  [project net BLE_VDD_4]
CHARGER_SD: MOD401.12(P12) Q402.G ; port CHARGER_SD
CMOD_TOUCH: C402.1 MOD401.16(P30)  [project net CMOD_TOUCH_4]
DISP_IREF: J401.12(IREF) R412.1  [project net DISP_IREF_4]
DISP_VCOMH: C405.2 J401.13(VCOMH)  [project net DISP_VCOMH_4]
DOUT_DISP_RESET: J401.9(RES#) U401.7(P5)  [project net DOUT_DISP_RESET_4]
I2C_SCL: J401.10(SCL) MOD401.10(P05_(TX,_i2cSCL)) R403.2 U401.10(SCL) U402.E1(SCL) ; port I2C_SCL
I2C_SDA: J401.11(SDA) MOD401.9(P04_(RX,_i2cSDA)) R404.2 U401.11(SDA) U402.D2(SDA) ; port I2C_SDA
LED_A: MOD401.2(P11) R401.1  [project net LED_A_4]
LED_B: MOD401.3(P10) R402.1  [project net LED_B_4]
MOUNT_SWITCH: MOD401.15(P13) R408.2 R409.2  [project net MOUNT_SWITCH_4]
P2.1: MOD401.17(P21) TP403.1(Test_Point)  [project net P2.1_4]
P2.2: MOD401.18(P22) TP402.1(Test_Point)  [project net P2.2_4]
P3.4: MOD401.21(P34) R407.2  [project net P3.4_4]
P3.5: MOD401.24(P35) R405.2  [project net P3.5_4]
RESET_SWITCH: C401.2 D402.2 MOD401.23(P37) R406.2 SW401.2  [project net RESET_SWITCH_4]
NetC308_2: SW402.1 ; port V_BATT
NetC403_2: C403.2 Q401.G Q402.D R410.2
NetC501_2: MOD401.31(P25) ; port AIN_IR_RECEIVER
NetD401_1: D401.1(R) R402.2
NetD401_2: D401.2(G) R401.2
NetD403_2: D403.2 Q401.S R408.1 SW402.2
NetMOD401_4: MOD401.4(P15) ; port CHARGER_MS
NetMOD401_6: MOD401.6(P07_(SWDCK)) ; port SWDCK
NetMOD401_8: MOD401.8(P14) ; port CHARGER_FLAG
NetMOD401_11: MOD401.11(P06_(SWDIO)) ; port SWDIO
NetMOD401_14: MOD401.14(P26) ; port SNS_TOUCH
NetMOD401_19: MOD401.19(P23) ; port DOUT_IR_EN
NetMOD401_22: MOD401.22(P31) ; port AI_LASER_CURRENT
NetMOD401_25: MOD401.25(P33) ; port IO_TP_2
NetMOD401_26: MOD401.26(Vref) TP401.1(Test_Point)
NetMOD401_27: MOD401.27(P32) ; port IO_TP_1
NetMOD401_28: MOD401.28(P36) ; port DOUT_IR_REC_VCC
NetMOD401_29: MOD401.29(XRES) ; port XRES
NetQ401_D: Q401.D ; port WAKE_UP
NetR301_1: U401.1(P0) ; port DOUT_DISP_9V_EN
NetR305_1: U401.9(P7) ; port CHARGER_MS_EN
NetR405_1: R405.1 ; port DEBUG_UART_TX
NetR407_1: R407.1 ; port DEBUG_UART_RX

Not connected (* = marked no-connect by the designer): J401 1(C2P)* 2(C2N)* 3(C1P)* 4(C1N)* 6(NC)*; U401 2(P1)* 3(P2)* 4(P3)* 6(P4)* 8(P6)*; U402 A1(~{WC})*

### Notes on the sheet
- CPU
- to operate at 2mA
  Green requires 1.9V > R550 Ohm
  Red requires 1.6V > R685 Ohm
- I2C
- (near TP401) C
- (near R406) Bounce time: 10ms using 41.2KOhm and 0.1µF
- RESET SWITCH
- D
- (near SW402) MOUNTING SWITCH
- E
- Pins as paceholders
- (near U402) Write protection disabled
- (near C406) DOUT_DISP_3V enabled from 9V input
- I2C EEPROM
- Device select code when addressing the memory array  (b1010000)
  Device select code when accessing the Identification page (b1011000)
- I2C DISPLAY (b0111100)
- I2C GPIO EXPANDER (b0100101)
- Title
- Customer, project
- Drawn By
- Board
- Size
- Document Number
- Sheet
- of
- Last modified
- Rev
- Build
- A3
- (in symbol LED GRN/RED DIFF 1208 R/A SMD) Anode; Common; +

### Library data of the parts
C401 = 0402C-0.1uF-10V: 0.1µF ±10% 10V X5R Ceramic Capacitor 0402; Manufacturer Part Number: CC0402KRX5R6BB104; Manufacturer: Yageo; Capacitance: 0.1µF; Digi-Key Part Number: 311-1336-1-ND; PackageReference: 0402; Temperature Coefficient: X5R; Tolerance: 10%; Voltage - Rated: 10V
C402 = 0402C-2.2nF-50V: 2.2nF ±10% 50V X5R Ceramic Capacitor 0402; Manufacturer Part Number: GRM155R61H222KA01D; Manufacturer: Murata Electronics North America; Capacitance: 2.2nF; Digi-Key Part Number: 490-8257-1-ND; PackageReference: 0402; Temperature Coefficient: X5R; Tolerance: 10%; Voltage - Rated: 50V
C403 = 0603C-22uF-10V: 22µF ±20% 10V Ceramic Capacitor X5R 0603; Manufacturer Part Number: C1608X5R1A226M080AC; Manufacturer: TDK Corporation; Capacitance: 22µF; Digi-Key Part Number: 445-9077-2-ND; PackageReference: 0603; Temperature Coefficient: X5R; Tolerance: 20%; Voltage - Rated: 10V
C404 C405 = 0402C-4.7uF-6.3V: as C302#1 on sheet 105358-3SC001-01-B_PWR_MGMT; Capacitance: 4.7µF; Digi-Key Part Number: 445-5947-1-ND; PackageReference: 0402; Temperature Coefficient: X5R; Tolerance: 10%; Voltage - Rated: 6.3V
C406 = 0402C-1uF-10V: as C301 on sheet 105358-3SC001-01-B_PWR_MGMT; Capacitance: 1µF; Digi-Key Part Number: 311-1439-1-ND; PackageReference: 0402; Temperature Coefficient: X5R; Tolerance: 10%; Voltage - Rated: 10V
D401 = LED GRN/RED DIFF 1208 R/A SMD: Manufacturer: Stanley Electric Co; Manufacturer Part Number: BRPY1211F-TR; Color: Red, Green; Voltage - Forward (Vf) (Typ): 2.1V Green, 1.7V Red; Current - Test: 20mA Green, 20mA Red; Wavelength - Peak: 570nm Green, 660nm Red; Millicandela Rating: 8.8mcd Green, 17.6mcd Red; ComponentLink1Description: Datasheet; ComponentLink1URL: https://media.digikey.com/pdf/Data%20Sheets/Stanley%20Electric%20PDFs/1211F_Series.pdf; Digi-Key Part Number: 404-1089-1-ND; ClassName: 3D_EXPORT
D402 D403 = TVS DIODE 15VWM 0402: as D201 on sheet 105358-3SC001-01-B_BlockDiagram; Manufacturer Part Number: LXES15AAA1-133; Digi-Key Part Number: 490-13209-1-ND; PackageReference: 0402
J401 = Molex-5034801400: Connector molex to OLED Display; Manufacturer: Molex, LLC; Number of Positions: 14; Pitch: 0.020" (0.50mm); Flat Flex Type: FFC, FPC; FFC, FCB Thickness: 0.30mm; Mating Cycles: 10; Manufacturer Part Number: 5034801400; Digi-Key Part Number: WM1442CT-ND; ComponentLink1Description: Datasheet; ComponentLink1URL: http://www.molex.com/pdm_docs/sd/5034801400_sd.pdf; Contact Finish: Gold; ClassName: 3D_EXPORT
L401 = BLM21PG331SN1D: 0805 Ferrite Bead 330Ohm@100MHz; Manufacturer: Murata Electronics North America; Number of Lines: 1; Current Rating (Max): 1.5A; Filter Type: Power Line; DC Resistance (DCR) (Max): 70 mOhm; Digi-Key Part Number: 490-5988-1-ND; Manufacturer Part Number: BLM21PG331SN1D; ComponentLink1Description: Datasheet; ComponentLink1URL: http://www.murata.com/en-global/products/productdata/8796733767710/S0580E.pdf; PackageReference: 0805 (2012 Metric); Impedance @ FRequency: 330 Ohm @ 100MHz
MOD401 = CYBLE-214009-00: BLE PSoC Module 4.1; Manufacturer: Cypress Semiconductor Corp; Protocol: Bluetooth v4.1; Frequency: 2.4GHz; Data Rate: 1Mbps; Power - Output: 3dBm; Sensitivity: -91dBm; Voltage - Supply: 1.7 V ~ 5.5 V; Current - Receiving: 16.4mA; Current - Transmitting: 15.6mA; Supplier 1: Digi-Key; Supplier Part Number 1: 428-3809-ND; ComponentLink1URL: http://www.cypress.com/file/223701/download; ComponentLink1Description: Datasheet; Manufacturer Part Number: CYBLE-214009-00; Digi-Key Part Number: 428-3809-ND; ClassName: 3D_EXPORT
Q401 Q403 = CSD23382F4: MOSFET P-CH 12V 22A 3PICOSTAR; Manufacturer: Texas Instruments; FET Type: P-Channel; Digi-Key Part Number: 296-40003-1-ND; Manufacturer Part Number: CSD23382F4; Package / Case: 3-XFDFN; ComponentLink1Description: Datasheet; ComponentLink1URL: http://www.ti.com/lit/ds/symlink/csd23382f4.pdf
Q402 = CSD13380F3T: 12V N-CHANNEL FEMTOFET MOSFET; Manufacturer: Texas Instruments; Digi-Key Part Number: CSD13380F3T; Manufacturer Part Number: CSD13380F3T; FET Type: N-Channel; Package / Case: 3-XFDFN; ComponentLink1Description: Datasheet; ComponentLink1URL: http://www.ti.com/lit/ds/symlink/csd13380f3.pdf
R401 = 0402R-698 OHM-1%-0.063W: RES SMD 698 OHM 1% 1/16W 0402; Manufacturer: Yageo; Manufacturer Part Number: RC0402FR-07698RL; Resistance (Ohms): 698Ohm; Power: 0.063W; GENERIC_OK: YES; Digi-Key Part Number: YAG3215CT-ND; Tolerance: 1%; PackageReference: 0402; Features: Moisture Resistant
R402 = 0402R-560 OHM-1%-0.063W: RES SMD 560OHM 1% 1/16W 0402; Manufacturer: Samsung Electro-Mechanics America, Inc.; Manufacturer Part Number: RC1005F561CS; Power: 0.063W; GENERIC_OK: YES; Digi-Key Part Number: 1276-3473-1-ND; Resistance (Ohms): 560Ohm; Tolerance: 1%; PackageReference: 0402; Features: Moisture Resistant
R403 R404 R411 = 0402R-10k OHM-1%-0.063W: as R308 on sheet 105358-3SC001-01-B_PWR_MGMT; Digi-Key Part Number: 311-10.0KLRCT-ND; Resistance (Ohms): 10KOhm; Tolerance: 1%; PackageReference: 0402; Features: Moisture Resistant
R405 R407 = 0402R-Do Not Place
R406 = 0402R-41.2k OHM-1%-0.063W: as R310 on sheet 105358-3SC001-01-B_PWR_MGMT; Digi-Key Part Number: YAG3155CT-ND; Resistance (Ohms): 41.2KOhm; Tolerance: 1%; PackageReference: 0402
R408 R412 = 0402R-390k OHM-1%-0.063W: RES SMD 390kOHM 1% 1/16W 0402; Manufacturer: Yageo; Manufacturer Part Number: RC0402FR-07390KL; Power: 0.063W; GENERIC_OK: YES; Digi-Key Part Number: YAG3143CT-ND; Resistance (Ohms): 390KOhm; Tolerance: 1%; PackageReference: 0402; Features: Moisture Resistant
R409 = 0402R-820k OHM-1%-0.063W: as R301 on sheet 105358-3SC001-01-B_PWR_MGMT; Digi-Key Part Number: YAG3240CT-ND; Resistance (Ohms): 820KOhm; Tolerance: 1%; PackageReference: 0402
R410 = 0402R-82k OHM-1%-0.063W: as R303 on sheet 105358-3SC001-01-B_PWR_MGMT; Digi-Key Part Number: 311-82.0KLRCT-ND; Resistance (Ohms): 82KOhm; Tolerance: 1%; PackageReference: 0402
SW401 SW402 = KXT311LHS: SPST Tactile Switch; Manufacturer: C&K; Contact Rating @ Voltage: 0.05A @ 12VDC; Actuator Height off PCB, Vertical: 0.60mm; Operating Force: 100gf; Mechanical Life: 300,000 Cycles; Supplier 1: Digi-Key; Supplier Part Number 1: CKN10777TR-ND; ComponentLink1URL: http://www.ckswitches.com/media/1465/kxt3.pdf; ComponentLink1Description: Datasheet; Manufacturer Part Number: KXT 311 LHS; Mounting Type: Surface Mount; Digi-Key Part Number: CKN10777CT-ND; ClassName: 3D_EXPORT
TP401-TP403 = TEST POINT: Testing Poiny; ClassName: TP
U401 = PCA9571GUX: IC I/O EXPANDER I2C 12XQFN; Manufacturer: NXP USA Inc.; Voltage - Supply: 1.1 V ~ 3.6 V; Clock Frequency: 1MHz; Interface: I²C; Output Type: Push-Pull; ComponentLink1URL: http://www.nxp.com/docs/en/data-sheet/PCA9571.pdf; ComponentLink1Description: Datasheet; Manufacturer Part Number: PCA9571GUX; PackageReference: 12-XFQFN; Digi-Key Part Number: 568-12400-1-ND
U402 = M24256-DFCS6TPK: IC EEPROM 256KBIT 1MHZ 8WLCSP; Manufacturer: STMicroelectronics; Memory Interface: I²C; Voltage - Supply: 1.7 V ~ 5.5 V; Memory Type: Non-Volatile; Write Cycle Time - Word, Page: 5ms; ComponentLink1URL: http://www.st.com/content/ccc/resource/technical/document/datasheet/b6/38/3e/3f/fe/a6/48/c2/CD00001891.pdf/files/CD00001891.pdf/jcr:content/translations/en.CD00001891.pdf; ComponentLink1Description: Dataseet; Manufacturer Part Number: M24256-DFCS6TP/K; PackageReference: 8-WFBGA; Memory Forma: EEPROM; Clock Frequency: 1MHz; Digi-Key Part Number: 497-13611-1-ND

## Sheet 105358-3SC001-01-B_IO_BRD.SchDoc: I/O Board
size 420 x 297 mm; DrawnBy: JeSa , KaKa; Organization: Hotswap Norden AB; Address1: Knarrarnäsgatan 7; Address2: SE-164 40 Kista; Address3: Sweden; DocumentNumber: 105358-3SC001-01; SheetNumber: 5; SheetTotal: 5; PageSetup: Record=PageOptions|CenterHorizontal=True|CenterVertical=True|PrintScale=0.96|XCorrection=1.00|YCorrection=1.00|PrintKind=0|BorderSize=5000000|LeftOffset=0|BottomOffset=0|Orientation=2|PaperLength=1000|PaperWidth=1000|Scale=100|PaperSource=7|PrintQuality=-4|MediaType=1|DitherType=10|PaperKind=A3|PrintScaleMode=1
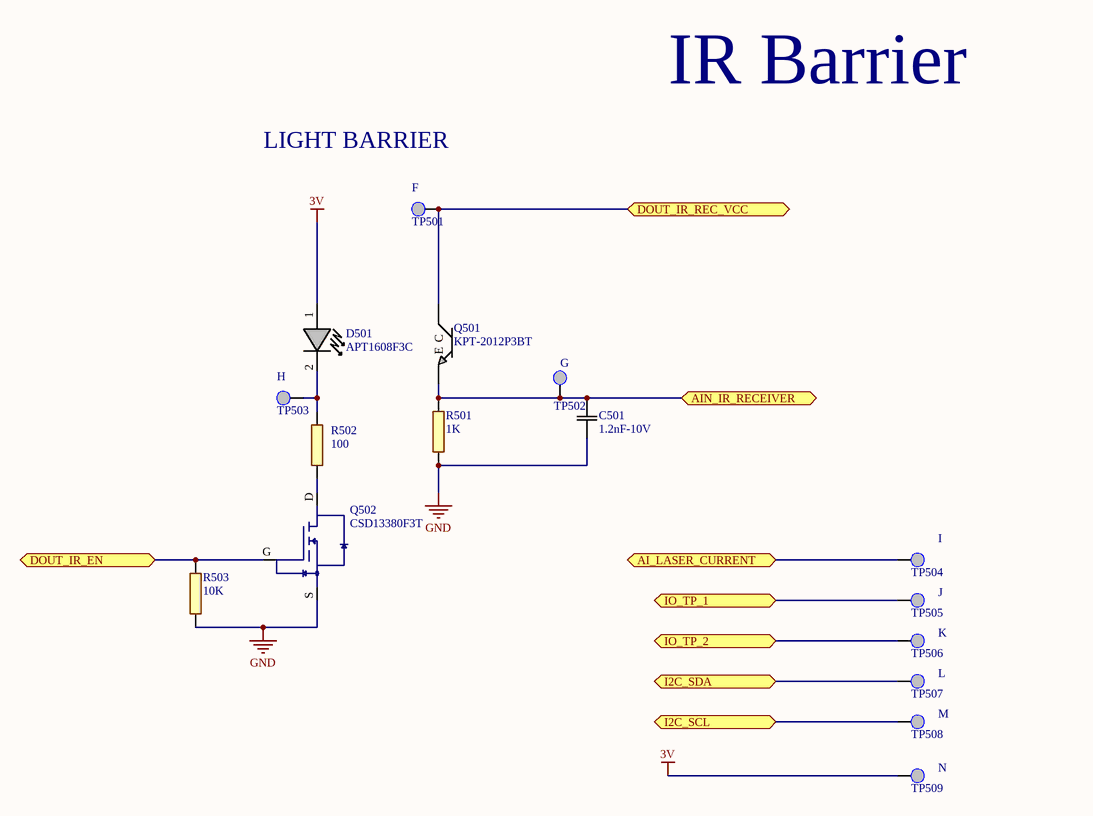
[diagram p4: 105358-3SC001-01-B_IO_BRD.SchDoc]

### Parts
C501  1.2nF-10V  [0402C_HIGH_DENSITY]
D501  APT1608F3C  [APT1608F3C]
Q501  KPT-2012P3BT  [APT2012P3BT]
Q502  CSD13380F3T  [CSD13380F3-DFN40P69X35-3L]
R501  1K  [0402R-GENERIC]
R502  100  [0402R-GENERIC]
R503  10K  [0402R-GENERIC]
TP501  TEST POINT  [PAD TEST POINT]  (value not drawn)  (no BOM)
TP502  TEST POINT  [PAD TEST POINT]  (value not drawn)  (no BOM)
TP503  TEST POINT  [PAD TEST POINT]  (value not drawn)  (no BOM)
TP504  TEST POINT  [PAD TEST POINT]  (value not drawn)  (no BOM)
TP505  TEST POINT  [PAD TEST POINT]  (value not drawn)  (no BOM)
TP506  TEST POINT  [PAD TEST POINT]  (value not drawn)  (no BOM)
TP507  TEST POINT  [PAD TEST POINT]  (value not drawn)  (no BOM)
TP508  TEST POINT  [PAD TEST POINT]  (value not drawn)  (no BOM)
TP509  TEST POINT  [PAD TEST POINT]  (value not drawn)  (no BOM)

### Ports
AI_LASER_CURRENT, AIN_IR_RECEIVER, DOUT_IR_EN, DOUT_IR_REC_VCC, I2C_SCL, I2C_SDA, IO_TP_1, IO_TP_2

### Nets
3V: D501.1(A) TP509.1(Test_Point)
GND: C501.1 Q502.S R501.2 R503.2
I2C_SCL: TP508.1(Test_Point) ; port I2C_SCL
I2C_SDA: TP507.1(Test_Point) ; port I2C_SDA
NetC501_2: C501.2 Q501.1(E) R501.1 TP502.1(Test_Point) ; port AIN_IR_RECEIVER
NetD501_2: D501.2(K) R502.1 TP503.1(Test_Point)
NetMOD401_19: Q502.G R503.1 ; port DOUT_IR_EN
NetMOD401_22: TP504.1(Test_Point) ; port AI_LASER_CURRENT
NetMOD401_25: TP506.1(Test_Point) ; port IO_TP_2
NetMOD401_27: TP505.1(Test_Point) ; port IO_TP_1
NetMOD401_28: Q501.2(C) TP501.1(Test_Point) ; port DOUT_IR_REC_VCC
NetQ502_D: Q502.D R502.2

### Notes on the sheet
- IR Barrier
- LIGHT BARRIER
- (near TP501) F
- (near TP503) H
- (near TP502) G
- (near TP504) I
- J
- K
- L
- M
- (near TP509) N
- Title
- Customer, project
- Drawn By
- Board
- Size
- Document Number
- Sheet
- of
- Last modified
- Rev
- Build
- A3

### Library data of the parts
C501 = 0402C-1.2nF-10V: 1.2nF ±10% 10V U2J Ceramic Capacitor 0402; Manufacturer Part Number: GRM1557U1A122JA01D; Manufacturer: Murata Electronics North America; Tolerance: 5%; Capacitance: 1.2nF; Digi-Key Part Number: 490-6272-1-ND; PackageReference: 0402; Temperature Coefficient: U2J; Voltage - Rated: 10V
D501 = APT1608F3C: 0603 INFRARED DIODE; Manufacturer: Kingbright; Wavelength: 940nm; Type: Infrared (IR); Current - DC Forward (If) (Max): 50mA; Radiant Intensity (Ie) Min @ If: 1.2mW/sr @ 20mA; Voltage - Forward (Vf) (Typ): 1.2V; Viewing Angle: 120°; Supplier 1: Digi-Key; Supplier Part Number 1: 754-1433-1-ND; Manufacturer Part Number: APT1608F3C; PackageReference: 0603; Mounting Type: Surface Mount; Operating Temperature: -40°C ~ 85°C (TA); ComponentLink1Description: Datasheet; ComponentLink1URL: http://www.kingbrightusa.com/images/catalog/SPEC/APT1608F3C.pdf; Digi-Key Part Number: 754-1433-1-ND; ClassName: 3D_EXPORT
Q501 = APT2012P3BT: 0805 PHOTOTRANSISTOR; Manufacturer: Kingbright; Voltage - Collector Emitter Breakdown (Max): 30V; Current - Collector (Ic) (Max): 1mA; Current - Dark (Id) (Max): 100nA; Power - Max: 100mW; Supplier 1: Digi-Key; Supplier Part Number 1: 754-1436-1-ND; ComponentLink1Description: Datasheet; ComponentLink1URL: https://www.kingbrightusa.com/images/catalog/spec/APT2012P3BT.pdf; Manufacturer Part Number: KPT-2012P3BT; PackageReference: 0805; Digi-Key Part Number: 754-1436-1-ND; ClassName: 3D_EXPORT
Q502 = CSD13380F3T: as Q402 on sheet 105358-3SC001-01-B_CPU_BRD; Digi-Key Part Number: CSD13380F3T; Manufacturer Part Number: CSD13380F3T; FET Type: N-Channel; Package / Case: 3-XFDFN; ComponentLink1Description: Datasheet; ComponentLink1URL: http://www.ti.com/lit/ds/symlink/csd13380f3.pdf
R501 = 0402R-1k OHM-1%-0.063W: RES SMD 1kOHM 1% 1/16W 0402; Power: 0.063W; GENERIC_OK: YES; Resistance (Ohms): 1KOhm; Tolerance: 1%; PackageReference: 0402
R502 = 0402R-100 OHM-1%-0.063W: RES SMD 100OHM 1% 1/16W 0402; Manufacturer: Yageo; Manufacturer Part Number: RC0402FR-07100RL; Power: 0.063W; GENERIC_OK: YES; Digi-Key Part Number: 311-100LRCT-ND; Resistance (Ohms): 100Ohm; Tolerance: 1%; PackageReference: 0402; Features: Moisture Resistant
R503 = 0402R-10k OHM-1%-0.063W: as R308 on sheet 105358-3SC001-01-B_PWR_MGMT; Digi-Key Part Number: 311-10.0KLRCT-ND; Resistance (Ohms): 10KOhm; Tolerance: 1%; PackageReference: 0402; Features: Moisture Resistant
TP501-TP509 = TEST POINT: Testing Poiny; ClassName: TP

## Nets that join several sheets
3V: 105358-3SC001-01-B_BlockDiagram (J203.1), 105358-3SC001-01-B_PWR_MGMT (C305.2 C306.2 U302.F4), 105358-3SC001-01-B_CPU_BRD (7 pins), 105358-3SC001-01-B_IO_BRD (D501.1 TP509.1)
9V: 105358-3SC001-01-B_PWR_MGMT (5 pins), 105358-3SC001-01-B_CPU_BRD (C404.1 J401.14)
GND: 105358-3SC001-01-B_BlockDiagram (5 pins), 105358-3SC001-01-B_PWR_MGMT (27 pins), 105358-3SC001-01-B_CPU_BRD (22 pins), 105358-3SC001-01-B_IO_BRD (C501.1 Q502.S R501.2 R503.2)
VCC_SYS: 105358-3SC001-01-B_PWR_MGMT (10 pins), 105358-3SC001-01-B_CPU_BRD (R410.1)
CHARGER_SD: 105358-3SC001-01-B_PWR_MGMT (R304.1 U302.A1), 105358-3SC001-01-B_CPU_BRD (MOD401.12 Q402.G)
I2C_SCL: 105358-3SC001-01-B_CPU_BRD (5 pins), 105358-3SC001-01-B_IO_BRD (TP508.1)
I2C_SDA: 105358-3SC001-01-B_CPU_BRD (5 pins), 105358-3SC001-01-B_IO_BRD (TP507.1)
NetC308_2: 105358-3SC001-01-B_PWR_MGMT (5 pins), 105358-3SC001-01-B_CPU_BRD (SW402.1)
NetC501_2: 105358-3SC001-01-B_CPU_BRD (MOD401.31), 105358-3SC001-01-B_IO_BRD (C501.2 Q501.1 R501.1 TP502.1)
NetMOD401_4: 105358-3SC001-01-B_PWR_MGMT (R306.2 R307.1), 105358-3SC001-01-B_CPU_BRD (MOD401.4)
NetMOD401_8: 105358-3SC001-01-B_PWR_MGMT (U302.E1), 105358-3SC001-01-B_CPU_BRD (MOD401.8)
NetMOD401_19: 105358-3SC001-01-B_CPU_BRD (MOD401.19), 105358-3SC001-01-B_IO_BRD (Q502.G R503.1)
NetMOD401_22: 105358-3SC001-01-B_CPU_BRD (MOD401.22), 105358-3SC001-01-B_IO_BRD (TP504.1)
NetMOD401_25: 105358-3SC001-01-B_CPU_BRD (MOD401.25), 105358-3SC001-01-B_IO_BRD (TP506.1)
NetMOD401_27: 105358-3SC001-01-B_CPU_BRD (MOD401.27), 105358-3SC001-01-B_IO_BRD (TP505.1)
NetMOD401_28: 105358-3SC001-01-B_CPU_BRD (MOD401.28), 105358-3SC001-01-B_IO_BRD (Q501.2 TP501.1)
NetQ401_D: 105358-3SC001-01-B_PWR_MGMT (U302.D2), 105358-3SC001-01-B_CPU_BRD (Q401.D)
NetR301_1: 105358-3SC001-01-B_PWR_MGMT (R301.1 U301#2.C1), 105358-3SC001-01-B_CPU_BRD (U401.1)
NetR305_1: 105358-3SC001-01-B_PWR_MGMT (R305.1 U302.C2), 105358-3SC001-01-B_CPU_BRD (U401.9)